# Altium schematic sheet Nguyen Quang Minh.SchDoc
size A0; SheetNumber: 1; SheetTotal: 1
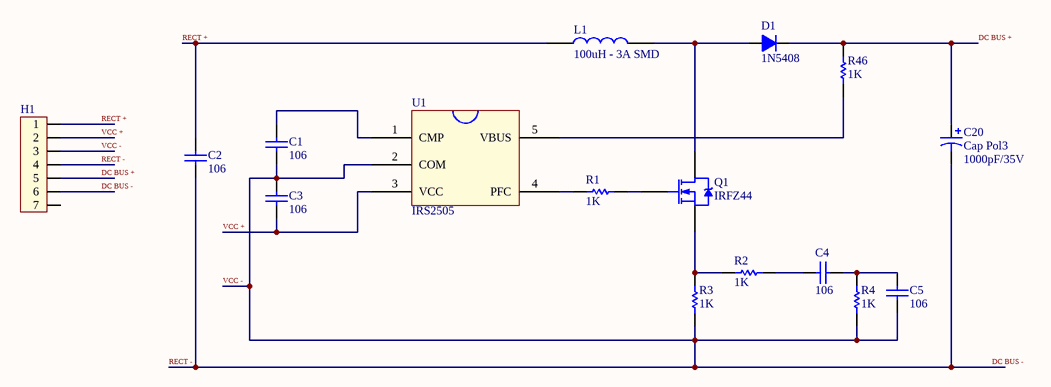
[diagram p0: Nguyen Quang Minh.SchDoc]

## Parts
C1  106  [tu 1206]
C2  106  [tu 1206]
C3  106  [tu 1206]
C4  106  [tu 1206]
C5  106  [tu 1206]
C20  Cap Pol3  value 1000pF/35V  [CP2/5]
D1  1N5408  [D5A]
H1  Header 7P 2.54 Duc Thang  [XH2.54M-7]  (value not drawn)
L1  100uH - 3A SMD  [Cuon Cam 12x12x10]
Q1  IRFZ44  [TO220]
R1  value 1K  [R1/4W]  (hidden comment: Res1)
R2  value 1K  [R1/4W]  (hidden comment: Res1)
R3  value 1K  [R1/4W]  (hidden comment: Res1)
R4  value 1K  [R1/4W]  (hidden comment: Res1)
R46  value 1K  [R1/4W]  (hidden comment: Res1)
U1  IRS2505  [IRS2505]

## Nets
DC BUS +: C20.1 D1.2(K) H1.5 R46.2
DC BUS -: C1.2 C2.2 C3.1 C5.2 C20.2 H1.3 H1.4 H1.6 R3.2 R4.2 U1.2(COM)  [also labelled RECT -, VCC -]
RECT +: C2.1 H1.1 L1.1
VCC +: C3.2 H1.2 U1.3(VCC)
NetC1_1: C1.1 U1.1(CMP)
NetC4_1: C4.1 R2.1
NetC4_2: C4.2 C5.1 R4.1
NetD1_1: D1.1(A) L1.2 Q1.2(D)
NetQ1_1: Q1.1(G) R1.1
NetQ1_3: Q1.3(S) R2.2 R3.1
NetR1_2: R1.2 U1.4(PFC)
NetR46_1: R46.1 U1.5(VBUS)

Not connected (* = marked no-connect by the designer): H1 7

## Library data of the parts
C1-C5 = Tu 1206 106 16V 20%: Dán; Don_Vi: Con; So_Chan: 2; Ten_Linh_Kien: Tụ 1206 106-10uF 20% 16V; Ma_Hang: MH004541; Chung_Loai: Dán; Kieu_Chan: *
C20 = Cap Pol3_2: Polarized Capacitor (Surface Mount); VALUE: C?; LatestRevisionDate: 17-Jul-2002; LatestRevisionNote: Re-released for DXP Platform.; PackageReference: C0805; Publisher: Altium Limited
D1 = D5A: Diode 5A; Value: 1N5408
H1 = Header 7P 2.54 Duc Thang: Cắm; Ten_Linh_Kien: Header 7P XH2.54-7P Đực Thẳng; Don_Vi: Con; Ma_Hang: MH003369; Chung_Loai: Cắm
L1 = CUON CAM 100uH SMD: Dán; Don_Vi: Con; Ma_Hang: MH003999; Ten_Linh_Kien: Cuộn Cảm 100uH 7x7x4MM CD74; Ma_Hang: *; Kieu_Chan: *; Chung_Loai: Dán
Q1 = IRFZ44 DIP: N-Channel Power MOSFET
R1-R4 R46 = Res1_1: Resistor; Manufacturer: Generic Components; Class: Passive; Published: 08/06/2000; Publisher: Altium Hobart Technology Centre; SubClass: Resistor